# Altium schematic sheet SLT3-PAY-1Q2T_P2.SchDoc: SVPXFMC Carrier 3U
size A3; CheckedBy: \; Author: G.Kasprowicz; CompanyName: ISE; DrawnBy: T.Przywozki; Organization: WUT ISE; Address1: Warsaw University of Technology; Address2: Nowowiejska 15/19 00-665 Warsaw; Revision: 1.0.; SheetNumber: 12; SheetTotal: 20; Project: SVPXFMC Carrier 3U; ModifiedBy: -; CheckedDate: -; Title2: SpaceVPX P2, SLT3-PAY-1Q2T; DivGrp: ISE; Designer: G. Kasprowicz
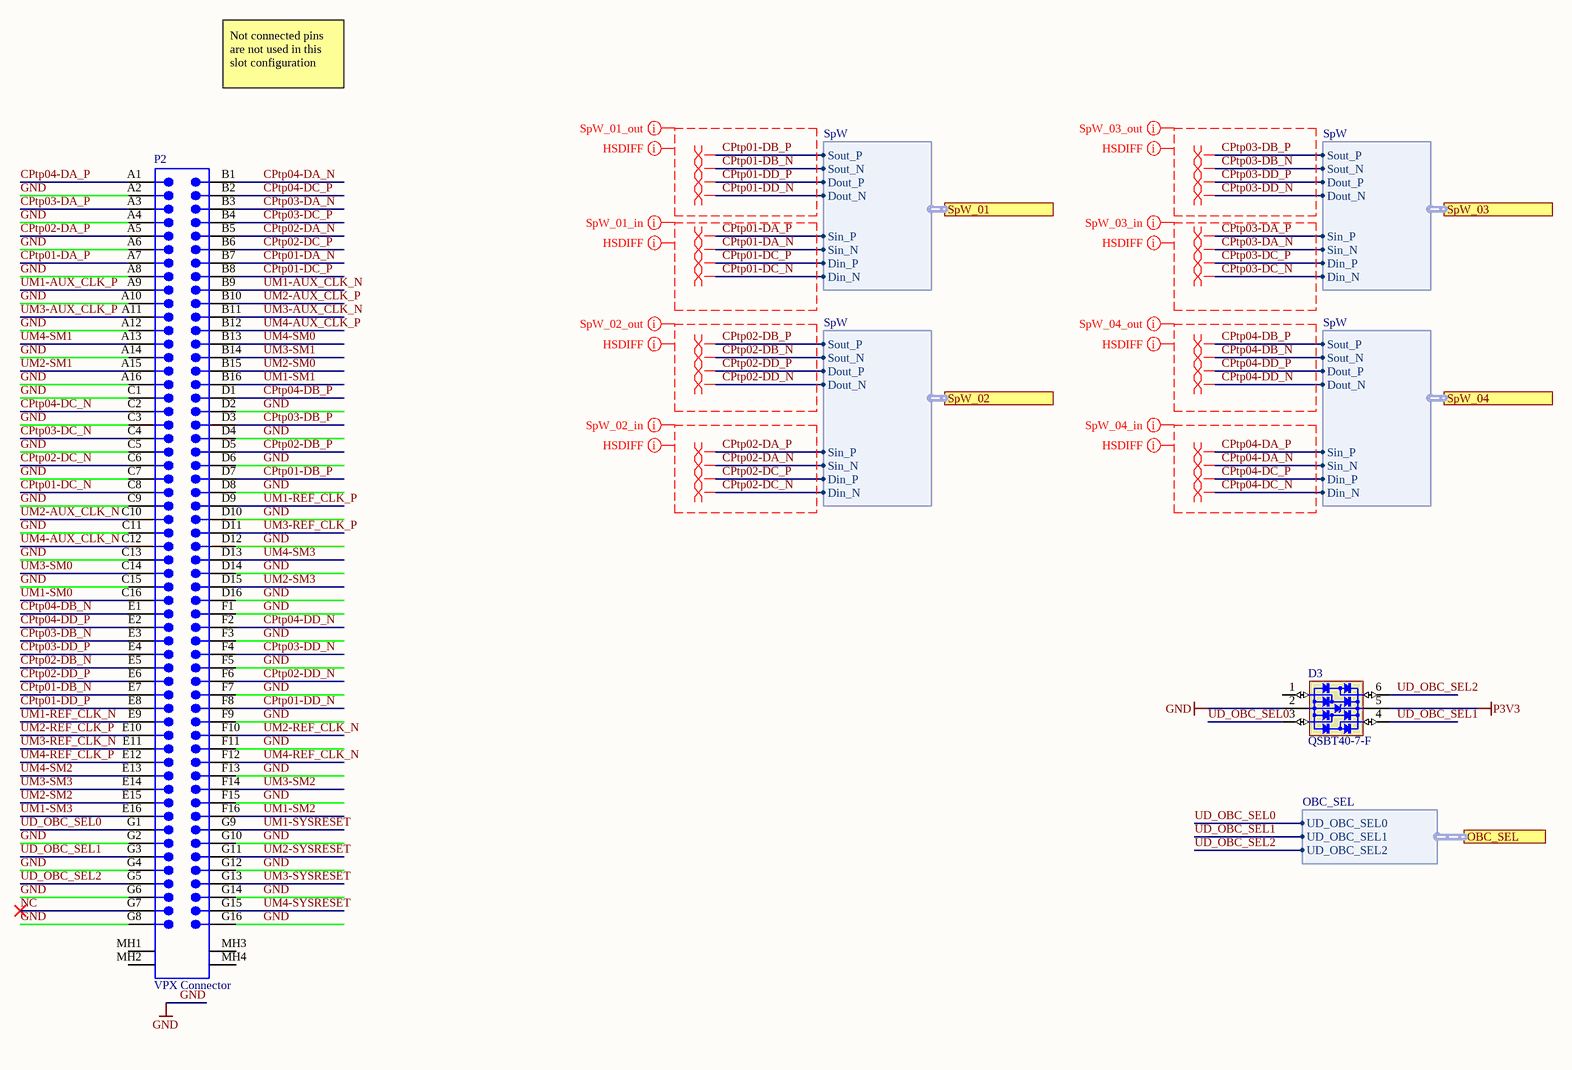
[diagram p0: SLT3-PAY-1Q2T_P2.SchDoc]

## Parts
D3  QSBT40-7-F  [SOT65P210X110-6N]
P2  VPX Connector  [BTB1-8-4H112M]

## Ports
OBC_SEL (harness OBC_SEL), SpW_01 (harness SpW), SpW_02 (harness SpW), SpW_03 (harness SpW), SpW_04 (harness SpW)

## Harnesses
SpW: Sout_P, Sout_N, Dout_P, Dout_N, Sin_P, Sin_N, Din_P, Din_N
OBC_SEL: UD_OBC_SEL0, UD_OBC_SEL1, UD_OBC_SEL2

## Nets
GND: D3.2(GND) P2.A2 P2.A4 P2.A6 P2.A8 P2.A10 P2.A12 P2.A14 P2.A16 P2.C1 P2.C3 P2.C5 P2.C7 P2.C9 P2.C11 P2.C13 P2.C15 P2.D2 P2.D4 P2.D6 P2.D8 P2.D10 P2.D12 P2.D14 P2.D16 P2.F1 P2.F3 P2.F5 P2.F7 P2.F9 P2.F11 P2.F13 P2.F15 P2.G2 P2.G4 P2.G6 P2.G8 P2.G10 P2.G12 P2.G14 P2.G16
P3V3: D3.5(VBUS)
CPtp01-DA_N: P2.B7 ; port SpW_01.Sin_N
CPtp01-DA_P: P2.A7 ; port SpW_01.Sin_P
CPtp01-DB_N: P2.E7 ; port SpW_01.Sout_N
CPtp01-DB_P: P2.D7 ; port SpW_01.Sout_P
CPtp01-DC_N: P2.C8 ; port SpW_01.Din_N
CPtp01-DC_P: P2.B8 ; port SpW_01.Din_P
CPtp01-DD_N: P2.F8 ; port SpW_01.Dout_N
CPtp01-DD_P: P2.E8 ; port SpW_01.Dout_P
CPtp02-DA_N: P2.B5 ; port SpW_02.Sin_N
CPtp02-DA_P: P2.A5 ; port SpW_02.Sin_P
CPtp02-DB_N: P2.E5 ; port SpW_02.Sout_N
CPtp02-DB_P: P2.D5 ; port SpW_02.Sout_P
CPtp02-DC_N: P2.C6 ; port SpW_02.Din_N
CPtp02-DC_P: P2.B6 ; port SpW_02.Din_P
CPtp02-DD_N: P2.F6 ; port SpW_02.Dout_N
CPtp02-DD_P: P2.E6 ; port SpW_02.Dout_P
CPtp03-DA_N: P2.B3 ; port SpW_03.Sin_N
CPtp03-DA_P: P2.A3 ; port SpW_03.Sin_P
CPtp03-DB_N: P2.E3 ; port SpW_03.Sout_N
CPtp03-DB_P: P2.D3 ; port SpW_03.Sout_P
CPtp03-DC_N: P2.C4 ; port SpW_03.Din_N
CPtp03-DC_P: P2.B4 ; port SpW_03.Din_P
CPtp03-DD_N: P2.F4 ; port SpW_03.Dout_N
CPtp03-DD_P: P2.E4 ; port SpW_03.Dout_P
CPtp04-DA_N: P2.B1 ; port SpW_04.Sin_N
CPtp04-DA_P: P2.A1 ; port SpW_04.Sin_P
CPtp04-DB_N: P2.E1 ; port SpW_04.Sout_N
CPtp04-DB_P: P2.D1 ; port SpW_04.Sout_P
CPtp04-DC_N: P2.C2 ; port SpW_04.Din_N
CPtp04-DC_P: P2.B2 ; port SpW_04.Din_P
CPtp04-DD_N: P2.F2 ; port SpW_04.Dout_N
CPtp04-DD_P: P2.E2 ; port SpW_04.Dout_P
NC: P2.G7
UD_OBC_SEL0: D3.3(I/O2) P2.G1 ; port OBC_SEL.UD_OBC_SEL0
UD_OBC_SEL1: D3.4(I/O3) P2.G3 ; port OBC_SEL.UD_OBC_SEL1
UD_OBC_SEL2: D3.6(I/O4) P2.G5 ; port OBC_SEL.UD_OBC_SEL2
UM1-AUX_CLK_N: P2.B9
UM1-AUX_CLK_P: P2.A9
UM1-REF_CLK_N: P2.E9
UM1-REF_CLK_P: P2.D9
UM1-SM0: P2.C16
UM1-SM1: P2.B16
UM1-SM2: P2.F16
UM1-SM3: P2.E16
UM1-SYSRESET: P2.G9
UM2-AUX_CLK_N: P2.C10
UM2-AUX_CLK_P: P2.B10
UM2-REF_CLK_N: P2.F10
UM2-REF_CLK_P: P2.E10
UM2-SM0: P2.B15
UM2-SM1: P2.A15
UM2-SM2: P2.E15
UM2-SM3: P2.D15
UM2-SYSRESET: P2.G11
UM3-AUX_CLK_N: P2.B11
UM3-AUX_CLK_P: P2.A11
UM3-REF_CLK_N: P2.E11
UM3-REF_CLK_P: P2.D11
UM3-SM0: P2.C14
UM3-SM1: P2.B14
UM3-SM2: P2.F14
UM3-SM3: P2.E14
UM3-SYSRESET: P2.G13
UM4-AUX_CLK_N: P2.C12
UM4-AUX_CLK_P: P2.B12
UM4-REF_CLK_N: P2.F12
UM4-REF_CLK_P: P2.E12
UM4-SM0: P2.B13
UM4-SM1: P2.A13
UM4-SM2: P2.E13
UM4-SM3: P2.D13
UM4-SYSRESET: P2.G15

Not connected (* = marked no-connect by the designer): D3 1(I/O1); P2 MH1 MH2 MH3 MH4

## Layout directives
differential pair: CPtp01-DA_N, CPtp01-DA_P, CPtp01-DB_N, CPtp01-DB_P, CPtp01-DC_N, CPtp01-DC_P, CPtp01-DD_N, CPtp01-DD_P, CPtp02-DA_N, CPtp02-DA_P, CPtp02-DB_N, CPtp02-DB_P, CPtp02-DC_N, CPtp02-DC_P, CPtp02-DD_N, CPtp02-DD_P, CPtp03-DA_N, CPtp03-DA_P, CPtp03-DB_N, CPtp03-DB_P, CPtp03-DC_N, CPtp03-DC_P, CPtp03-DD_N, CPtp03-DD_P, CPtp04-DA_N, CPtp04-DA_P, CPtp04-DB_N, CPtp04-DB_P, CPtp04-DC_N, CPtp04-DC_P, CPtp04-DD_N, CPtp04-DD_P
net class SpW_01_out: CPtp01-DB_N, CPtp01-DB_P, CPtp01-DD_N, CPtp01-DD_P
net class SpW_01_in: CPtp01-DA_N, CPtp01-DA_P, CPtp01-DC_N, CPtp01-DC_P
net class SpW_02_out: CPtp02-DB_N, CPtp02-DB_P, CPtp02-DD_N, CPtp02-DD_P
net class SpW_02_in: CPtp02-DA_N, CPtp02-DA_P, CPtp02-DC_N, CPtp02-DC_P
net class HSDIFF: CPtp01-DA_N, CPtp01-DA_P, CPtp01-DB_N, CPtp01-DB_P, CPtp01-DC_N, CPtp01-DC_P, CPtp01-DD_N, CPtp01-DD_P, CPtp02-DA_N, CPtp02-DA_P, CPtp02-DB_N, CPtp02-DB_P, CPtp02-DC_N, CPtp02-DC_P, CPtp02-DD_N, CPtp02-DD_P, CPtp03-DA_N, CPtp03-DA_P, CPtp03-DB_N, CPtp03-DB_P, CPtp03-DC_N, CPtp03-DC_P, CPtp03-DD_N, CPtp03-DD_P, CPtp04-DA_N, CPtp04-DA_P, CPtp04-DB_N, CPtp04-DB_P, CPtp04-DC_N, CPtp04-DC_P, CPtp04-DD_N, CPtp04-DD_P
net class SpW_03_out: CPtp03-DB_N, CPtp03-DB_P, CPtp03-DD_N, CPtp03-DD_P
net class SpW_03_in: CPtp03-DA_N, CPtp03-DA_P, CPtp03-DC_N, CPtp03-DC_P
net class SpW_04_out: CPtp04-DB_N, CPtp04-DB_P, CPtp04-DD_N, CPtp04-DD_P
net class SpW_04_in: CPtp04-DA_N, CPtp04-DA_P, CPtp04-DC_N, CPtp04-DC_P

## Notes on the sheet
- Not connected pins are not used in this slot configuration
- Title
- Size:
- Date:
- A3
- Number:
- Time:
- Revision:
- Sheet
- of
- File:

## Library data of the parts
D3 = D_TVS_QSBT40-7-F: Bonding: No; PressFit: No; Case: *; Component Kind: Standard; Component Type: Standard; ComponentHeigth: *; CreateDate: 2018-01-01; Device: QSBT40-7-F; Footprint: SOT363; HelpURL: *; LatestRevisionDate: 2018-01-01; Manufacturer: *; Manufacturer Part Number: QSBT40-7-F; Mounted: Yes; PackageDescription: *; Part Description: *; Part Number: *; Pin Count: 6; Sense: No; SMD: Yes; Socket: No; Value: *
P2 = 2102771-1: Ruggedized Board-to-Board Connector, Right Angle, 7-Row, Pitch 1.8mm, 112-Position; Manufacturer: TE; Bonding: No; ComponentHeigth: 14.7mm; PressFit: No; Case: *; Component Kind: Standard; Component Type: Standard; CreateDate: 2018-01-01; Device: *; Footprint: *; HelpURL: *; LatestRevisionDate: 2018-01-01; Manufacturer Part Number: 2102771-1; Mounted: Yes; PackageDescription: 2102771-1; Part Description: Ruggedized Board-to-Board Connector, Right Angle, 7-Row, Pitch 1.8mm, 112-Position; Part Number: 2102771-1; Pin Count: *; Sense: No; SMD: Yes; Socket: No; Family: VPX Connector